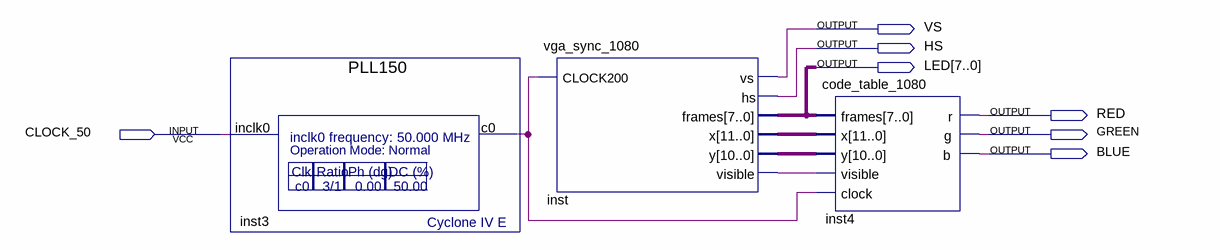
[diagram p0: schematic sheet]
// Quartus schematic VGA.bdf as structural Verilog: 3 symbols, 7 pins
module VGA (
  input  CLOCK_50,
  output VS,
  output HS,
  output [7:0] LED,
  output RED,
  output GREEN,
  output BLUE
);

  wire inst3_c0, inst_visible;
  wire [10:0] inst_y;
  wire [11:0] inst_x;

  PLL150 inst3 (.inclk0(CLOCK_50), .c0(inst3_c0));
  vga_sync_1080 inst (
    .CLOCK200(inst3_c0), .vs(VS), .hs(HS), .frames(LED), .x(inst_x), .y(inst_y), .visible(inst_visible));
  code_table_1080 inst4 (
    .frames(LED), .x(inst_x), .y(inst_y), .visible(inst_visible), .clock(inst3_c0), .r(RED), .g(GREEN),
    .b(BLUE));
endmodule
